# EAGLE design poe_injector (EAGLE 6.2)
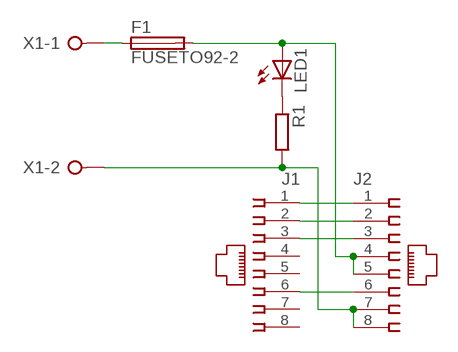
[diagram p0: schematic, sheet 1]

## Parts
F1  FUSETO92-2  [TO92-2]
J1  520251-4  [520251-4]
J2  520251-4  [520251-4]
LED1  LED3MM  [LED3MM]
R1  R-EU_0207/10  [0207/10]
X1  W237-02P  [W237-132]

## Nets
GND-7,8: J2.7 J2.8 R1.2 X1.2
N$1: J1.1 J2.1
N$2: J1.2 J2.2
N$3: J1.3 J2.3
N$4: J1.6 J2.6
N$7: LED1.K(C) R1.1
N$9: F1.1 X1.1
VCC-5,6: F1.3 J2.4 J2.5 LED1.A
Unconnected: J1.4 J1.5 J1.7 J1.8

## Library data of the parts
F1 = myparts:FUSE: Fuse
J1 J2 = con-amp:520251-4: AMP connector
LED1 = led:LED: LED OSRAM: - CHIPLED LG R971, LG N971, LY N971, LG Q971, LY Q971, LO R971, LY R971 LH N974, LH R974 LS Q976, LO Q976, LY Q976 LO Q996 - Hyper CHIPLED LW Q18S LB Q993, LB Q99A, LB R99A - SideLED LS A670, LO A670, LY A670, LG A670, LP A670 LB A673, LV A673, LT A673, LW A673 LH A674 LY A675 LS A676, LA A676, LO A676, LY A676, LW A676 LS A679, LY A679, LG A679 - Hyper Micro SIDELED® LS Y876, LA Y876, LO Y876, LY Y876 LT Y87S - SmartLED LW L88C, LW L88S LB L89C, LB L89S, LG L890 LS L89K, LO L89K, LY L89K LS L896, LA L896, LO L896, LY L896 - TOPLED LS T670, LO T670, LY T670, LG T670, LP T670 LSG T670, LSP T670, LSY T670, LOP T670, LYG T670 LG T671, LOG T671, LSG T671 LB T673, LV T673, LT T673, LW T673 LH T674 LS T676, LA T676, LO T676, LY T676, LB T676, LH T676, LSB T676, LW T676 LB T67C, LV T67C, LT T67C, LS T67K, LO T67K, LY T67K, LW E67C LS E67B, LA E67B, LO E67B, LY E67B, LB E67C, LV E67C, LT E67C LW T67C LS T679, LY T679, LG T679 LS T770, LO T770, LY T770, LG T770, LP T770 LB T773, LV T773, LT T773, LW T773 LH T774 LS E675, LA E675, LY E675, LS T675 LS T776, LA T776, LO T776, LY T776, LB T776 LHGB T686 LT T68C, LB T68C - Hyper Mini TOPLED® LB M676 - Mini TOPLED Santana® LG M470 LS M47K, LO M47K, LY M47K Source: http://www.osram.convergy.de LUXEON: - LUMILED® LXK2-PW12-R00, LXK2-PW12-S00, LXK2-PW14-U00, LXK2-PW14-V00 LXK2-PM12-R00, LXK2-PM12-S00, LXK2-PM14-U00 LXK2-PE12-Q00, LXK2-PE12-R00, LXK2-PE12-S00, LXK2-PE14-T00, LXK2-PE14-U00 LXK2-PB12-K00, LXK2-PB12-L00, LXK2-PB12-M00, LXK2-PB14-N00, LXK2-PB14-P00, LXK2-PB14-Q00 LXK2-PR12-L00, LXK2-PR12-M00, LXK2-PR14-Q00, LXK2-PR14-R00 LXK2-PD12-Q00, LXK2-PD12-R00, LXK2-PD12-S00 LXK2-PH12-R00, LXK2-PH12-S00 LXK2-PL12-P00, LXK2-PL12-Q00, LXK2-PL12-R00 Source: www.luxeon.com KINGBRIGHT: KA-3528ASYC Source: www.kingbright.com
R1 = rcl:R-EU_: RESISTOR, European symbol
X1 = con-wago-508:W237-02P: WAGO SREW CLAMP; OC_FARNELL: unknown; OC_NEWARK: unknown

## Board
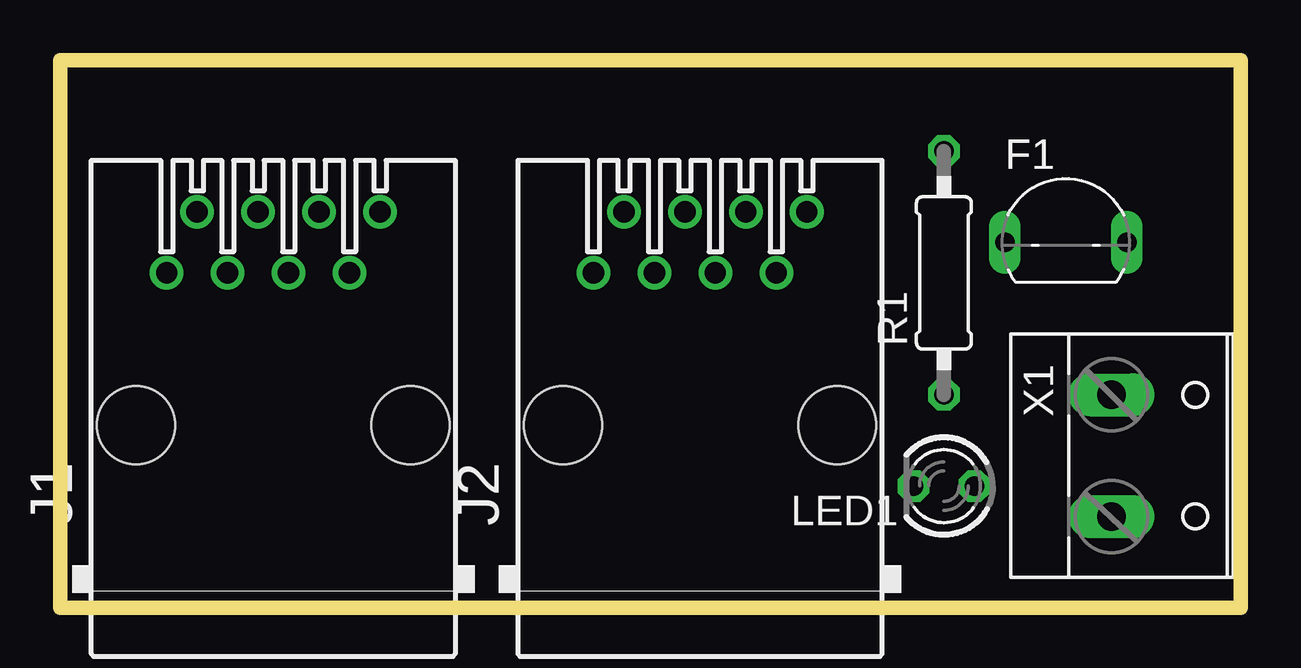
[diagram p1: board, top side]
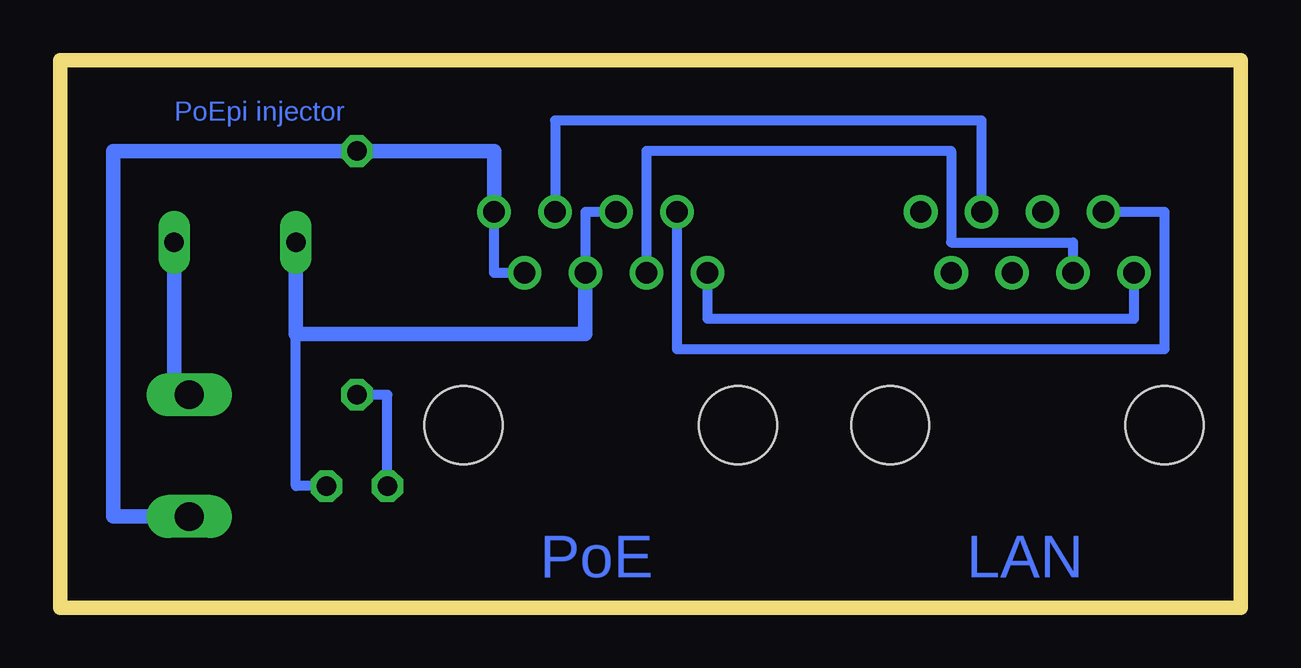
[diagram p2: board, bottom side, seen from below]

Size 49.2 x 22.85 mm. Coordinates in mm from the lower left corner, seen from the top.
Outline: 0,0 49.2,0 49.2,22.85 0,22.85 0,0
Copper layers (1*16): Top 0.035mm / dielectric 1.5mm / Bottom 0.035mm
Design rules "default": minimum track width 10mil, minimum drill 24mil, track to track 8mil, track to pad 8mil, pad to pad 8mil, via to via 8mil, smd to smd 8mil, copper to edge 40mil, drill to drill 8mil, minimum pad ring 10mil, minimum via ring 8mil, stop-mask expansion 4mil, vias tented up to drill 0mil, thermal gap 10mil

### Footprints (pad centres in the part's own frame; a part is rotated, then mirrored left to right if it is on the bottom)
TO92-2 = drill 0.813 long: 1 2.54,0; 3 -2.54,0
520251-4 = drill 0.889: 1 -4.445,6.35; 2 -3.175,8.89; 3 -1.905,6.35; 4 -0.635,8.89; 5 0.635,6.35; 6 1.905,8.89; 7 3.175,6.35; 8 4.445,8.89 | hole 3.251: -5.715,0; 5.715,0
LED3MM = drill 0.813 octagon: A -1.27,0; K 1.27,0
0207/10 = drill 0.813 octagon: 1 -5.08,0; 2 5.08,0
W237-132 = drill 1.194 long: 1 -2.54,-0.635; 2 2.54,-0.635

### Placement (x,y rotation side)
F1  41.91,15.24 0 top
J1  8.89,7.62 0 top
J2  26.67,7.62 0 top
LED1  36.83,5.08 180 top
R1  36.83,13.97 90 top
X1  44.45,6.35 270 top

### Tracks (layer width: path | path; a pad name or v marks a point on that pad's centre or on a via)
GND-7,8
  Bottom 0.406: J2.7 31.11,13.97 J2.8
  Bottom 0.61: J2.8 31.11,19.05 R1.2 46.99,19.05 46.99,3.81 X1.2
N$1
  Bottom 0.406: J2.1 22.23,12.06 4.45,12.06 J1.1
N$2
  Bottom 0.406: J2.2 23.5,10.79 3.17,10.79 3.17,16.51 J1.2
N$3
  Bottom 0.406: J1.3 6.99,15.24 12.06,15.24 12.06,19.05 24.77,19.05 J2.3
N$4
  Bottom 0.406: J1.6 10.79,20.32 28.57,20.32 J2.6
N$7
  Bottom 0.406: LED1.K 35.56,8.89 R1.1
N$9
  Bottom 0.61: X1.1 44.45,8.89 F1.1
VCC-5,6
  Bottom 0.406: LED1.A 39.37,5.08 F1.3 | J2.4 27.3,16.51 J2.5
  Bottom 0.61: J2.5 27.3,11.43 39.37,11.43 F1.3

### Text on the board
Bottom: PoEpi injector | LAN | PoE